# Altium schematic sheet ADC-RDC-ADC.SchDoc
size A3
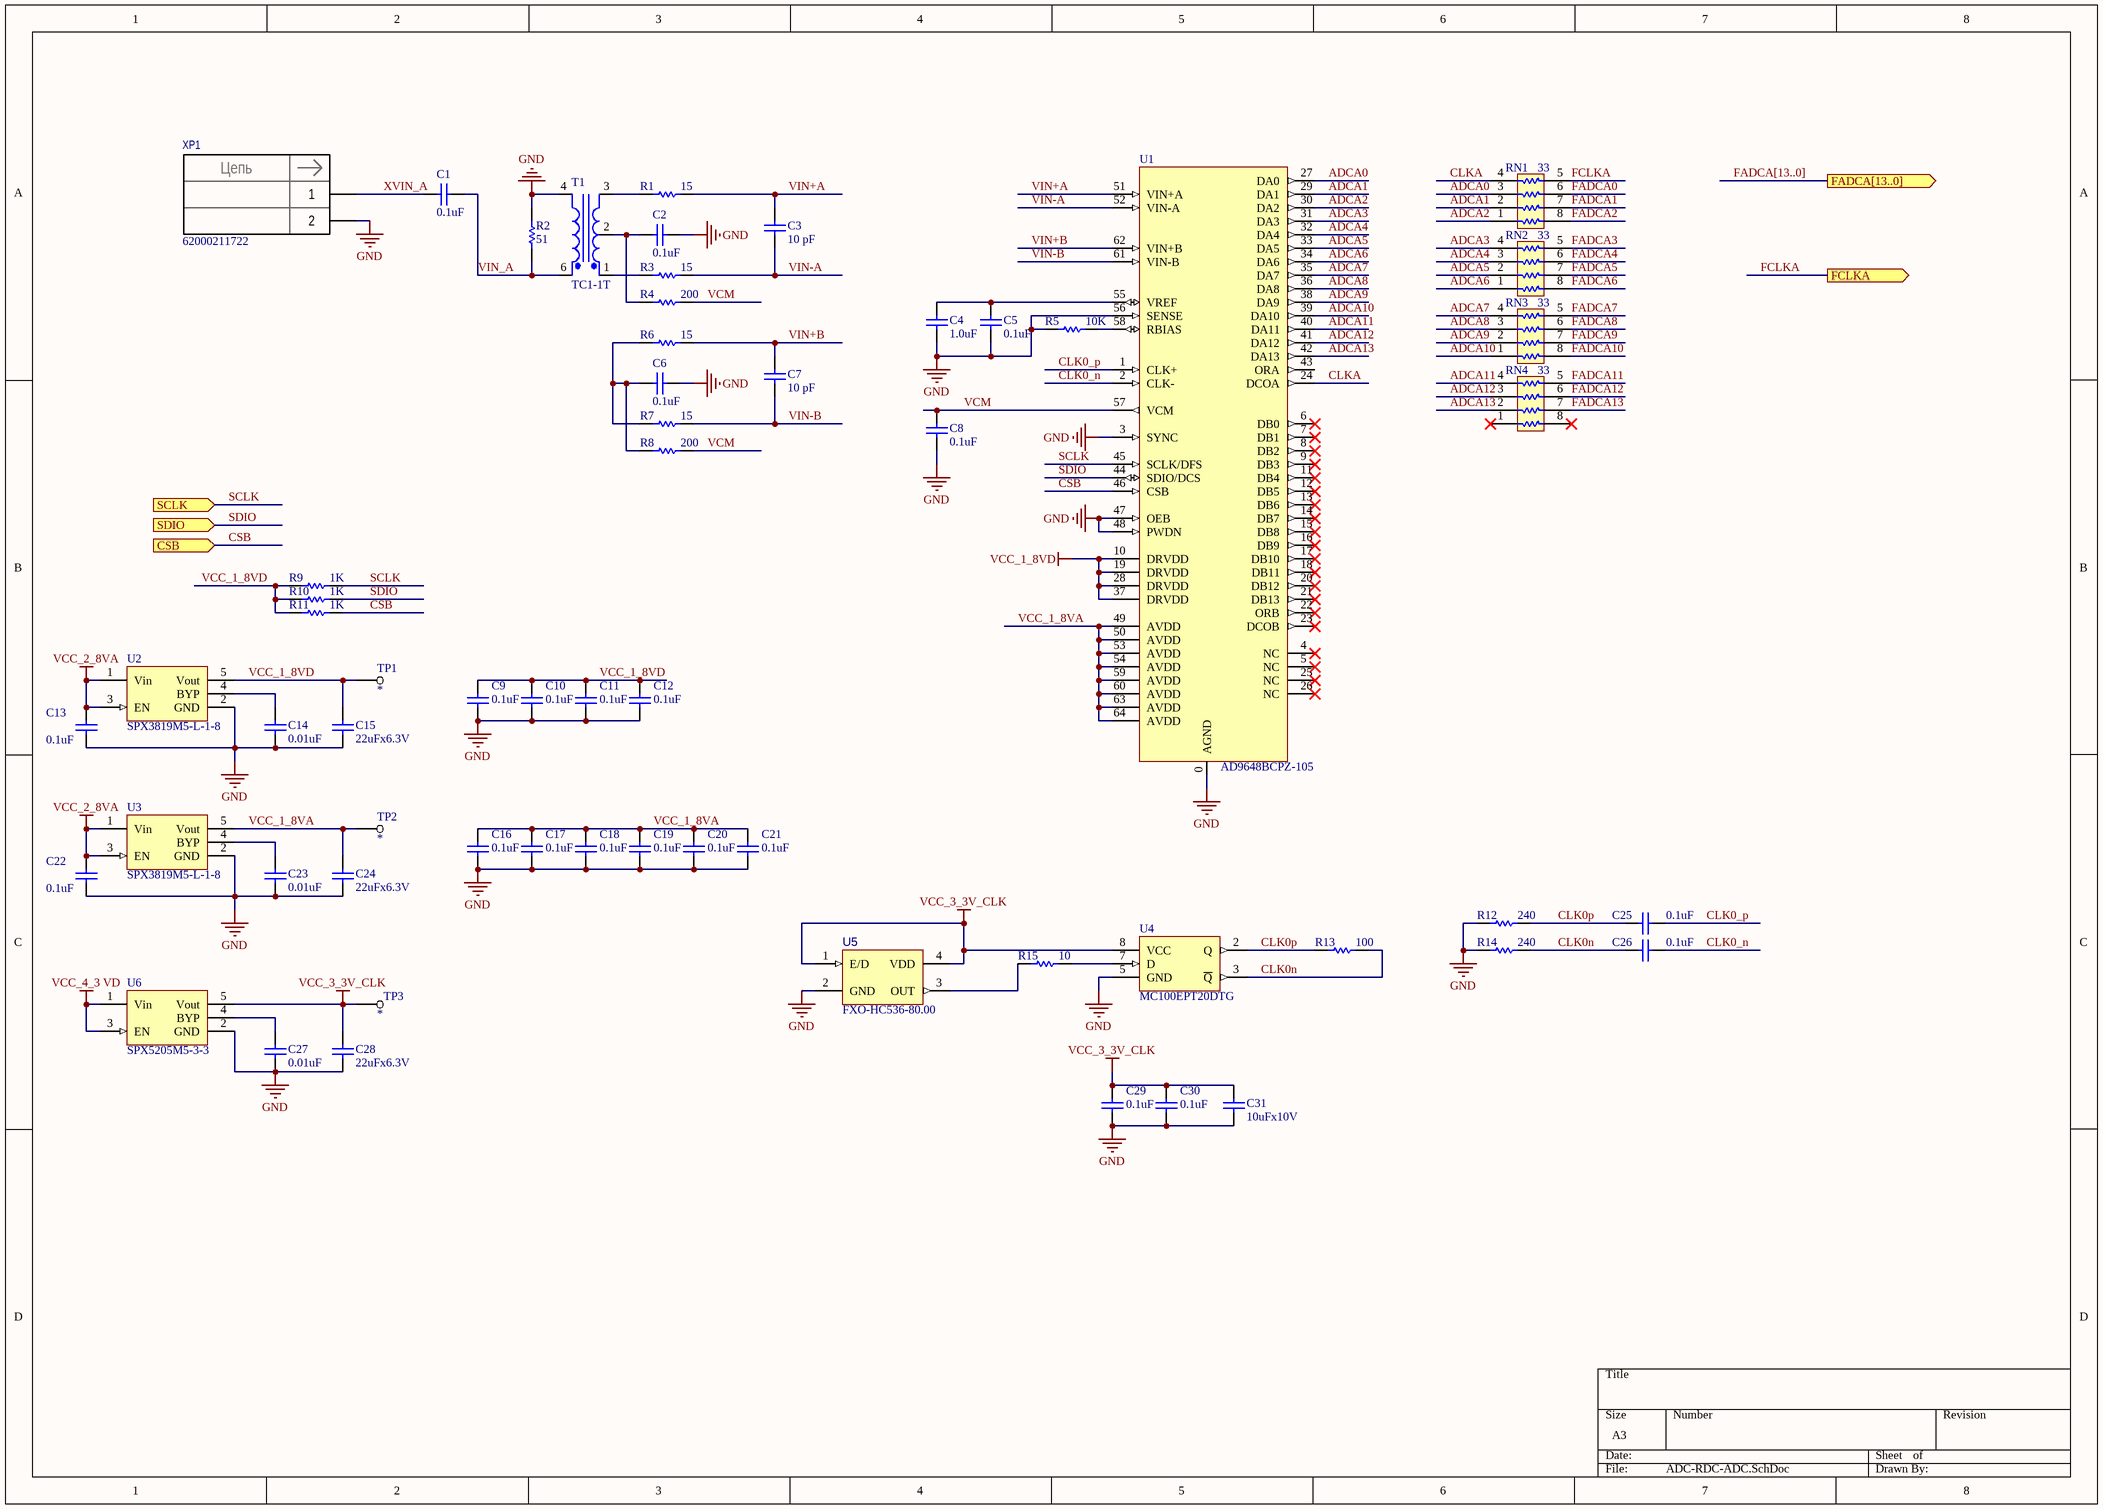
[diagram p0: ADC-RDC-ADC.SchDoc]

## Parts
C1  0.1uF  [C0603]
C2  0.1uF  [C0603]
C3  10 pF  [C0603]
C4  1.0uF  [C0603L]
C5  0.1uF  [C0603L]
C6  0.1uF  [C0603]
C7  10 pF  [C0603]
C8  0.1uF  [C0603L]
C9  0.1uF  [C0603]
C10  0.1uF  [C0603]
C11  0.1uF  [C0603]
C12  0.1uF  [C0603]
C13  0.1uF  [C0603]
C14  0.01uF  [C0603]
C15  22uFx6.3V  [C0805]
C16  0.1uF  [C0603L]
C17  0.1uF  [C0603L]
C18  0.1uF  [C0603L]
C19  0.1uF  [C0603L]
C20  0.1uF  [C0603L]
C21  0.1uF  [C0603L]
C22  0.1uF  [C0603]
C23  0.01uF  [C0603]
C24  22uFx6.3V  [C0805]
C25  0.1uF  [C0603L]
C26  0.1uF  [C0603L]
C27  0.01uF  [C0603]
C28  22uFx6.3V  [C0805]
C29  0.1uF  [C0603]
C30  0.1uF  [C0603]
C31  10uFx10V  [C0805]
R1  15  [R0603]
R2  51  [R0805]
R3  15  [R0603]
R4  200  [R0603]
R5  10K  [R0603L]
R6  15  [R0603]
R7  15  [R0603]
R8  200  [R0603]
R9  1K  [R0603]
R10  1K  [R0603]
R11  1K  [R0603]
R12  240  [R0603]
R13  100  [R0603]
R14  240  [R0603]
R15  10  [R0603]
RN1  33  [EXB38V]
RN2  33  [EXB38V]
RN3  33  [EXB38V]
RN4  33  [EXB38V]
T1  TC1-1T  [SM-22]
TP1  *  [TP_1_06]  (no BOM)
TP2  *  [TP_1_06]  (no BOM)
TP3  *  [TP_1_06]  (no BOM)
U1  AD9648BCPZ-105  [CP-64-4]
U2  SPX3819M5-L-1-8  [SOT23-5]
U3  SPX3819M5-L-1-8  [SOT23-5]
U4  MC100EPT20DTG  [TSSOP8]
U5  FXO-HC536-80.00  [HC5]
U6  SPX5205M5-3-3  [SOT23-5]
XP1  Component_name: 62000211722  [conP_WR-WTB_62000211722-2pin_P2000_60x76x48_L]  (hidden comment: plug_62000211722_WR-WTB_2pin_horiz)

## Ports
CSB (in), FADCA[13..0] (out), FCLKA (out), SCLK (in), SDIO (in)

## Nets
GND: C2.2 C4.1 C5.1 C6.2 C8.1 C9.1 C10.1 C11.1 C12.1 C13.1 C14.1 C15.1 C16.1 C17.1 C18.1 C19.1 C20.1 C21.1 C22.1 C23.1 C24.1 C27.1 C28.1 C29.1 C30.1 C31.1 R2.2 R5.1 R12.1 R14.1 T1.4(Pri-) U1.0(AGND) U1.3(SYNC) U1.47(OEB) U1.48(PWDN) U1.56(SENSE) U2.2(GND) U3.2(GND) U4.5(GND) U5.2(GND) U6.2(GND) XP1.2
VCC_1_8VD: C9.2 C10.2 C11.2 C12.2 C15.2 R9.1 R10.1 R11.1 TP1.1 U1.10(DRVDD) U1.19(DRVDD) U1.28(DRVDD) U1.37(DRVDD) U2.5(Vout)
VCC_2_8VA: C13.2 C22.2 U2.1(Vin) U2.3(EN) U3.1(Vin) U3.3(EN)
VCC_3_3V_CLK: C28.2 C29.2 C30.2 C31.2 TP3.1 U4.8(VCC) U5.1(E/D) U5.4(VDD) U6.5(Vout)
VCC_4_3 VD: U6.1(Vin) U6.3(EN)
ADCA0: RN1.3 U1.27(DA0)
ADCA1: RN1.2 U1.29(DA1)
ADCA2: RN1.1 U1.30(DA2)
ADCA3: RN2.4 U1.31(DA3)
ADCA4: RN2.3 U1.32(DA4)
ADCA5: RN2.2 U1.33(DA5)
ADCA6: RN2.1 U1.34(DA6)
ADCA7: RN3.4 U1.35(DA7)
ADCA8: RN3.3 U1.36(DA8)
ADCA9: RN3.2 U1.38(DA9)
ADCA10: RN3.1 U1.39(DA10)
ADCA11: RN4.4 U1.40(DA11)
ADCA12: RN4.3 U1.41(DA12)
ADCA13: RN4.2 U1.42(DA13)
CLK0_n: C26.2 U1.2(CLK-)
CLK0_p: C25.2 U1.1(CLK+)
CLK0n: C26.1 R13.2 R14.2 U4.3(~{Q})
CLK0p: C25.1 R12.2 R13.1 U4.2(Q)
CLKA: RN1.4 U1.24(DCOA)
CSB: R11.2 U1.46(CSB) ; port CSB
FADCA0: RN1.6
FADCA1: RN1.7
FADCA2: RN1.8
FADCA3: RN2.5
FADCA4: RN2.6
FADCA5: RN2.7
FADCA6: RN2.8
FADCA7: RN3.5
FADCA8: RN3.6
FADCA9: RN3.7
FADCA10: RN3.8
FADCA11: RN4.5
FADCA12: RN4.6
FADCA13: RN4.7
FCLKA: RN1.5 ; port FCLKA
SCLK: R9.2 U1.45(SCLK/DFS) ; port SCLK
SDIO: R10.2 U1.44(SDIO/DCS) ; port SDIO
VCC_1_8VA: C16.2 C17.2 C18.2 C19.2 C20.2 C21.2 C24.2 TP2.1 U1.49(AVDD) U1.50(AVDD) U1.53(AVDD) U1.54(AVDD) U1.59(AVDD) U1.60(AVDD) U1.63(AVDD) U1.64(AVDD) U3.5(Vout)
VCM: C8.2 R4.2 R8.2 U1.57(VCM)
VIN+A: C3.1 R1.2 U1.51(VIN+A)
VIN+B: C7.1 R6.2 U1.62(VIN+B)
VIN-A: C3.2 R3.2 U1.52(VIN-A)
VIN-B: C7.2 R7.2 U1.61(VIN-B)
VIN_A: C1.1 R2.1 T1.6(Pri+)
XVIN_A: C1.2 XP1.1
NetC2_1: C2.1 R4.1 T1.2(SecCT)
NetC4_2: C4.2 C5.2 U1.55(VREF)
NetC6_1: C6.1 R6.1 R7.1 R8.1
NetC14_2: C14.2 U2.4(BYP)
NetC23_2: C23.2 U3.4(BYP)
NetC27_2: C27.2 U6.4(BYP)
NetR1_1: R1.1 T1.3(Sec-)
NetR3_1: R3.1 T1.1(Sec+)
NetR5_2: R5.2 U1.58(RBIAS)
NetR15_1: R15.1 U5.3(OUT)
NetR15_2: R15.2 U4.7(D)

Not connected (* = marked no-connect by the designer): RN4 1* 8*; U1 4(NC)* 5(NC)* 6(DB0)* 7(DB1)* 8(DB2)* 9(DB3)* 11(DB4)* 12(DB5)* 13(DB6)* 14(DB7)* 15(DB8)* 16(DB9)* 17(DB10)* 18(DB11)* 20(DB12)* 21(DB13)* 22(ORB)* 23(DCOB)* 25(NC)* 26(NC)* 43(ORA)

## Buses and harness runs
bus FADCA[13..0] = port FADCA[13..0]

## Notes on the sheet
- (in symbol plug_62000211722_WR-WTB_2pin_horiz) Цепь

## Library data of the parts
C1-C31 = Cap: Capacitor, 2pin; ValueSCH: *; ValueBOM: *; MarkPCB: *
R1-R15 = RES: Resistor, 2pin; ValueSCH: *; ValueBOM: *; MarkPCB: *
RN1-RN4 = x4 Resistor Array: ValueSCH: *; ValueBOM: *; MarkPCB: *
T1 = TC1-1T: Center-Tapped Transformer (Ideal)
TP1-TP3 = Test_point: Test point; ValueSCH: *; ValueBOM: *; MarkPCB: *
U1 = AD9648BCPZ-105: 14-Bit, 125 MSPS/105 MSPS, 1.8 V Dual  Analog-to-Digital Converter; MarkPCB: *; ValueBOM: *; ValueSCH: *
U2 U3 = SPX3819M5-L-1-8: LDO Voltage Regulator; ValueSCH: *; ValueBOM: *; MarkPCB: *
U4 = MC100EPT20DT: 3.3 V TTL/CMOS to differential PECL translator; ValueSCH: *; ValueBOM: *; MarkPCB: *
U5 = SG-636PTF-40.0000: Surface Mount Crystal Oscillator; MarkPCB: *; ValueBOM: *; ValueSCH: *
U6 = SPX5205M5-3-3: LDO Voltage Regulator; ValueSCH: *; ValueBOM: *; MarkPCB: *
XP1 = plug_62000211722_WR-WTB_2pin_horiz: 2.00mm Male Horizontal Shrouded Header WR-WTB; Part_number_PROSA: D-VI-6267; Manufacturer: "Wurth Elektronik"; LxWxH(mm): 6,0x7,6x4,8; Area(mm2): 45,6; Number_of_pads: 2; Mounting_type: Standard; Component_ID: plug_62000211722_WR-WTB_2pin_horiz; Component Class: Plug_PCB_mounting; Type: Вилки; PROSA_name (Old name): 62000211722; Package: conP_WR-WTB_62000211722-2pin_P2000_60x76x48; Case_code: WR-WTB_2pin_horiz; Height(mm): 4,8; ComponentLink1Description: plug_62000211722.pdf; ComponentLink1URL: C:\chkout_AltiumLib\Datasheets\Electromechanics_datasheet\Connectors\plug_62000211722.pdf; HelpURL: C:\chkout_AltiumLib\Datasheets\Electromechanics_datasheet\Connectors\plug_62000211722.pdf; ComponentLink2Description: plug_62000211722_URL_Link; ComponentLink2URL: http://katalog.we-online.com/en/em/WTB_2_00_MALE_HORIZONTAL_SHROUDED_HEADER_6200XX11722/62000211722?sid=a40b27176d